# EAGLE design sushi-wing-v3 (EAGLE 7.7.0)
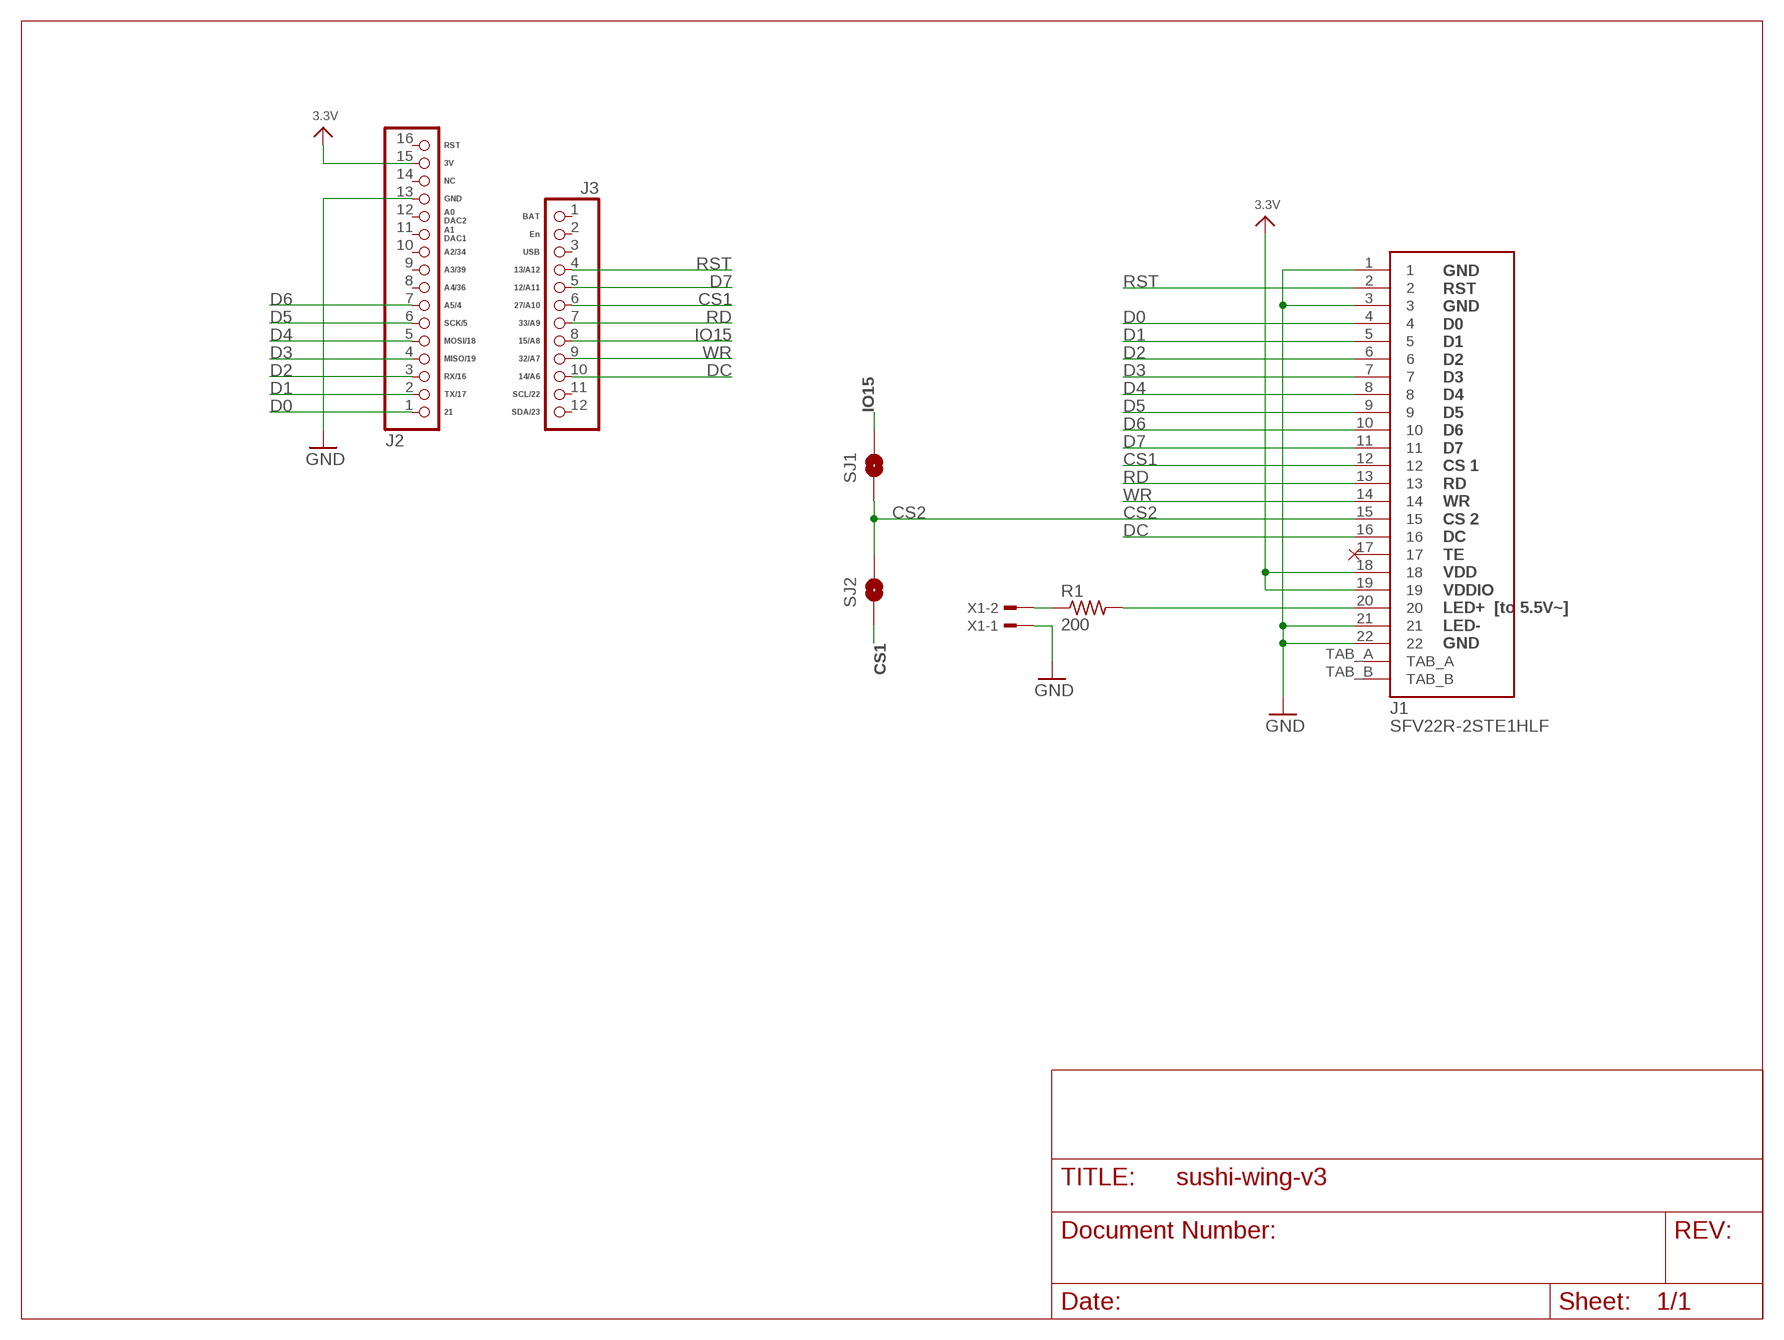
[diagram p0: schematic, sheet 1]

## Parts
J1  SFV22R-2STE1HLF  [SFV22R-2STE1HLF]
J2  HEADER-1X16_MIN  [1X16_ROUND_MIN]
J3  HEADER-1X12_MIN  [1X12_ROUND_MIN]
R1  200  R-US_R1206  [R1206]
SJ1  SOLDERJUMPERNO  [SJ_2S-NO]
SJ2  SOLDERJUMPERNO  [SJ_2S-NO]
X1  TSW-102-02-S-S-RA  [TSW-102-02-S-S-RA]

## Nets
3.3V: J1.18 J1.19 J2.15
CS1: J1.12 J3.6 SJ2.1
CS2: J1.15 SJ1.1 SJ2.2
D0: J1.4 J2.1
D1: J1.5 J2.2
D2: J1.6 J2.3
D3: J1.7 J2.4
D4: J1.8 J2.5
D5: J1.9 J2.6
D6: J1.10 J2.7
D7: J1.11 J3.5
DC: J1.16 J3.10
GND: J1.1 J1.3 J1.21 J1.22 J2.13 X1.1
IO15: J3.8 SJ1.2
N$2: R1.1 X1.2
N$20: J1.20 R1.2
RD: J1.13 J3.7
RST: J1.2 J3.4
WR: J1.14 J3.9
Unconnected: J1.17 J1.TAB_A J1.TAB_B J2.8 J2.9 J2.10 J2.11 J2.12 J2.14 J2.16 J3.1 J3.2 J3.3 J3.11 J3.12

## Notes on the sheet
- RST
- 3V
- NC
- GND
- A0
  DAC2
- BAT
- A1
  DAC1
- En
- A2/34 | USB
- GND
  RST
  GND
  D0
  D1
  D2
  D3
  D4
  D5
  D6
  D7
  CS 1
  RD
  WR
  CS 2
  DC
  TE
  VDD
  VDDIO
  LED+  [to 5.5V~]
  LED-
  GND
- A3/39 | 13/A12
- A4/36 | 12/A11
- A5/4 | 27/A10
- SCK/5 | 33/A9
- MOSI/18 | 15/A8
- MISO/19 | 32/A7
- RX/16 | 14/A6
- TX/17 | SCL/22
- 21 | SDA/23

## Library data of the parts
J1 = SFV22R-2STE1HLF:SFV22R-2STE1HLF
J2 = microbuilder:HEADER-1X16: PIN HEADER
J3 = microbuilder:HEADER-1X12
R1 = rcl:R-US_: RESISTOR, American symbol
SJ1 SJ2 = SparkFun:SOLDERJUMPER: Solder Jumper Standard SMD solder jumper. Used to automate production. Two varients : Normally Open and Normally Closed are the same, but have different paste layers. NC will have a large amount of paste and should jumper during reflow.
X1 = con-samtec:TSW-102-02-S-S: THROUGH-HOLE .025" SQ POST HEADER Source: Samtec TSW.pdf; OC_FARNELL: unknown; OC_NEWARK: unknown

## Board
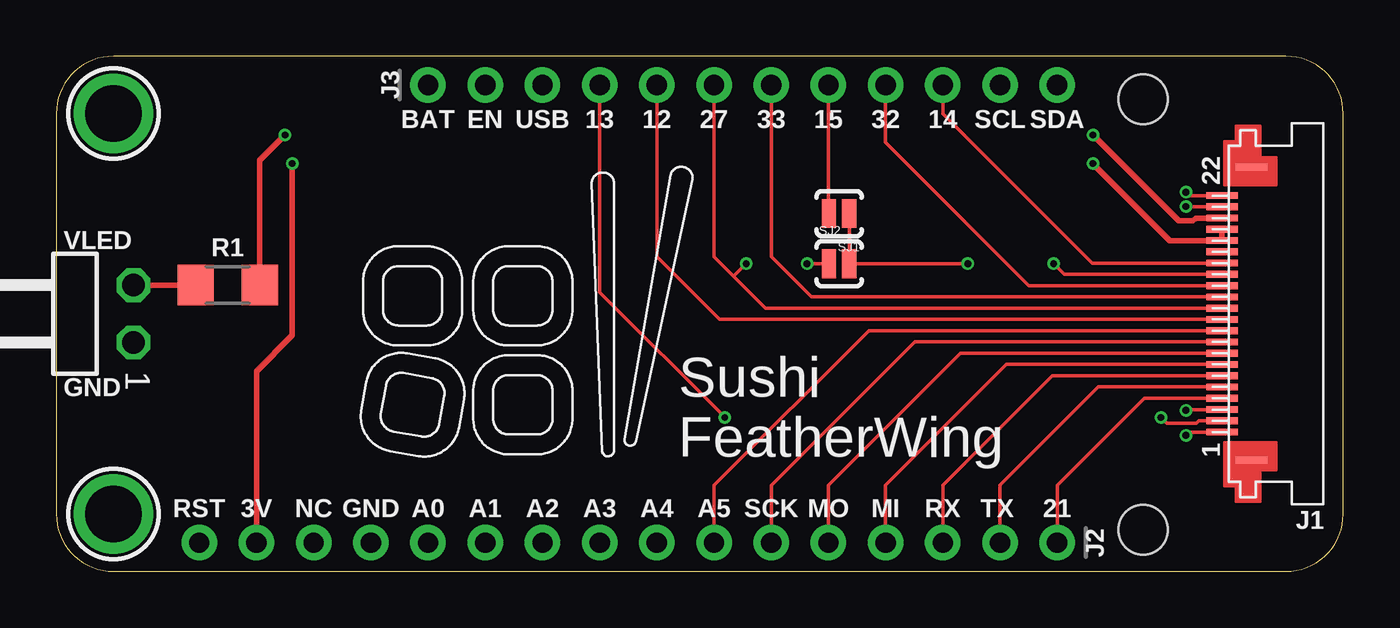
[diagram p1: board, top side]
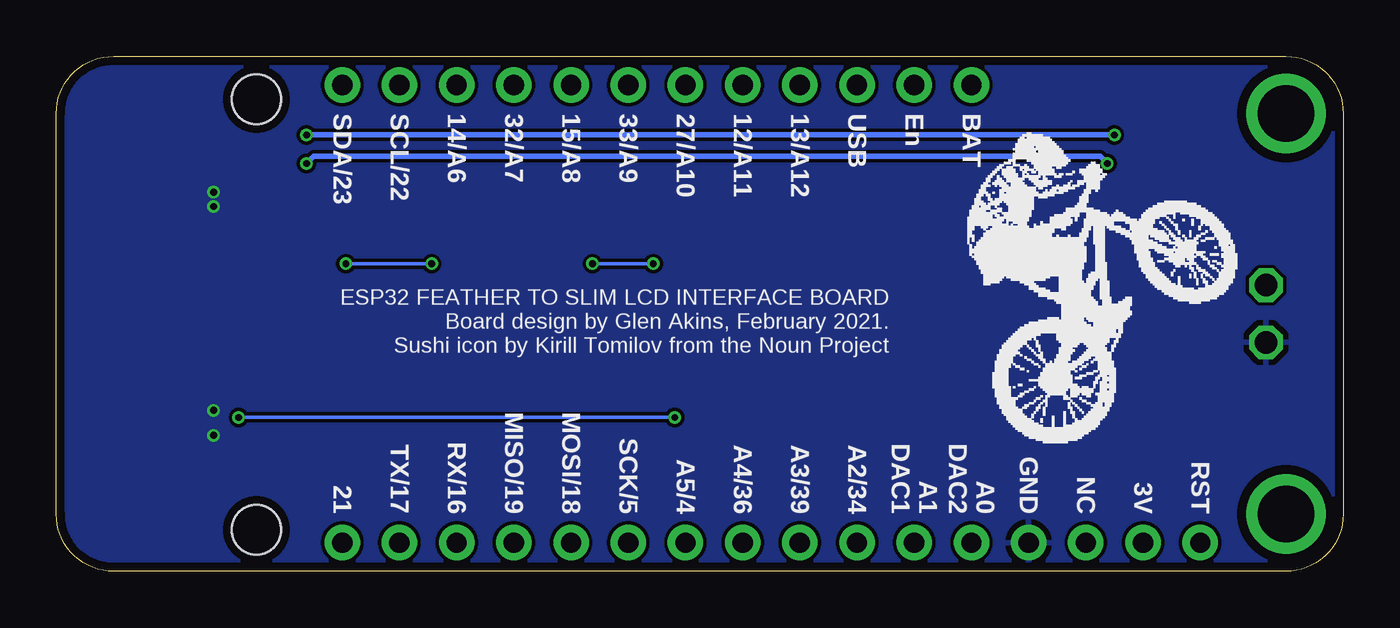
[diagram p2: board, bottom side, seen from below]

Size 57.15 x 22.86 mm. Coordinates in mm from the lower left corner, seen from the top.
Outline: 2.54,0 54.61,0 arc90 57.15,2.54 57.15,20.32 arc90 54.61,22.86 2.54,22.86 arc90 0,20.32 0,2.54 arc90 2.54,0
Copper layers (1*16): Top 0.035559375mm / dielectric 1.6mm / Bottom 0.035559375mm
Design rules "oshpark-2layer-2018": minimum track width 6mil, minimum drill 10mil, track to track 6mil, track to pad 6mil, pad to pad 6mil, via to via 6mil, smd to smd 6mil, copper to edge 15mil, drill to drill 6mil, minimum pad ring 5mil, minimum via ring 5mil, stop-mask expansion 2.5mil, vias tented up to drill 0mil, thermal gap 10mil
Holes 2.2 mm at 48.26,1.84 48.26,20.95

### Footprints (pad centres in the part's own frame; a part is rotated, then mirrored left to right if it is on the bottom)
SFV22R-2STE1HLF = smd 0.3 x 1.4: 1 -5.25,0.3; 2 -4.75,0.3; 3 -4.25,0.3; 4 -3.75,0.3; 5 -3.25,0.3; 6 -2.75,0.3; 7 -2.25,0.3; 8 -1.75,0.3; 9 -1.25,0.3; 10 -0.75,0.3; 11 -0.25,0.3; 12 0.25,0.3; 13 0.75,0.3; 14 1.25,0.3; 15 1.75,0.3; 16 2.25,0.3; 17 2.75,0.3; 18 3.25,0.3; 19 3.75,0.3; 20 4.25,0.3; 21 4.75,0.3; 22 5.25,0.3; TAB_A -6.5,-1; TAB_B 6.5,-1
1X16_ROUND_MIN = drill 0.9 pad 1.575: 1 -19.05,0; 2 -16.51,0; 3 -13.97,0; 4 -11.43,0; 5 -8.89,0; 6 -6.35,0; 7 -3.81,0; 8 -1.27,0; 9 1.27,0; 10 3.81,0; 11 6.35,0; 12 8.89,0; 13 11.43,0; 14 13.97,0; 15 16.51,0; 16 19.05,0
1X12_ROUND_MIN = drill 0.9 pad 1.575: 1 -13.97,0; 2 -11.43,0; 3 -8.89,0; 4 -6.35,0; 5 -3.81,0; 6 -1.27,0; 7 1.27,0; 8 3.81,0; 9 6.35,0; 10 8.89,0; 11 11.43,0; 12 13.97,0
R1206 = smd 1.6 x 1.803: 1 -1.422,0; 2 1.422,0
SJ_2S-NO = smd 0.635 x 1.27: 1 -0.45,0; 2 0.45,0
MOUNTINGHOLE_2.5_PLATED = drill 2.5 pad 3.2: P$1 0,0
TSW-102-02-S-S-RA = drill 1 pad 1.5 octagon: 1 1.27,1.524; 2 -1.27,1.524

### Placement (x,y rotation side)
J1  52.07,11.43 90 top
J2  25.4,1.27 180 top
J3  30.48,21.59 0 top
R1  7.62,12.7 0 top
SJ1  34.77,15.88 180 top
SJ2  34.77,13.65 0 top
U$31  MOUNTINGHOLE2.5  [MOUNTINGHOLE_2.5_PLATED]  2.54,20.32 270 top
U$32  MOUNTINGHOLE2.5  [MOUNTINGHOLE_2.5_PLATED]  2.54,2.54 270 top
X1  1.91,11.43 270 top

### Tracks (layer width: path | path; a pad name or v marks a point on that pad's centre or on a via)
3.3V  (via drill 0.3)
  Top 0.254: J2.15 8.89,8.89 10.48,10.48 v10.48,18.1 | v46.04,18.1 49.45,14.68 J1.18 J1.19
  Bottom 0.254: v10.48,18.1 10.79,18.41 45.72,18.41 v46.04,18.1
CS1  (via drill 0.3)
  Top 0.152: J1.12 31.5,11.68 30.08,13.1 | 30.08,13.1 29.21,13.97 J3.6 | v30.64,13.65 30.08,13.1 | SJ2.1 v33.34,13.65
  Bottom 0.152: v33.34,13.65 v30.64,13.65
CS2  (via drill 0.3)
  Top 0.152: J1.15 44.76,13.18 v44.29,13.65 | v40.48,13.65 SJ2.2 SJ1.1
  Bottom 0.152: v44.29,13.65 v40.48,13.65
D0
  Top 0.152: J2.1 44.45,3.81 48.32,7.68 J1.4
D1
  Top 0.152: J1.5 46.28,8.18 41.91,3.81 J2.2
D2
  Top 0.152: J1.6 44.24,8.68 39.37,3.81 J2.3
D3
  Top 0.152: J1.7 42.2,9.18 36.83,3.81 J2.4
D4
  Top 0.152: J1.8 40.16,9.68 34.29,3.81 J2.5
D5
  Top 0.152: J1.9 38.12,10.18 31.75,3.81 J2.6
D6
  Top 0.152: J1.10 36.08,10.68 29.21,3.81 J2.7
D7
  Top 0.152: J1.11 29.46,11.18 26.67,13.97 J3.5
DC
  Top 0.152: J1.16 46.01,13.68 39.37,20.32 J3.10
GND  (via drill 0.3)
  Top 0.152: J1.21 v50.15,16.18 v50.16,16.19 | J1.22 50.31,16.68 v50.16,16.83 | J1.1 50.31,6.18 v50.16,6.03 | J1.3 50.36,7.18 v50.16,7.14
  pour Bottom (isolate 0.152): 0,0 57.15,0 57.15,22.86 0,22.86
IO15
  Top 0.152: J3.8 34.29,15.9 SJ1.2
N$2
  Top 0.254: X1.2 R1.1
N$20  (via drill 0.3)
  Top 0.254: v10.16,19.37 9.04,18.25 R1.2 | J1.20 50.6,15.68 50.48,15.56 49.85,15.56 v46.04,19.37
  Bottom 0.254: v46.04,19.37 v10.16,19.37
RD
  Top 0.152: J1.13 33.54,12.18 31.75,13.97 J3.7
RST  (via drill 0.3)
  Top 0.152: J1.2 50.73,6.68 50.62,6.58 49.52,6.58 49.52,6.57 49.31,6.57 v49.05,6.83 49.2,6.68 | J3.4 24.13,12.38 v29.69,6.83
  Bottom 0.152: v29.69,6.83 v49.05,6.83
WR
  Top 0.152: J1.14 43.2,12.68 36.83,19.05 J3.9

### Text on the board
_tsilk: BAT | EN | USB | 13 | 12 | 27 | 33 | 15 | 32 | 14 | SCL | SDA | 22 | VLED | GND | 1 | Sushi / FeatherWing | RST | 3V | NC | GND | A0 | A1 | A2 | A3 | A4 | A5 | SCK | MO | MI | RX | TX | 21
_bsilk: BAT | En | USB | 13/A12 | 12/A11 | 27/A10 | 33/A9 | 15/A8 | 32/A7 | 14/A6 | SCL/22 | SDA/23 | ESP32 FEATHER TO SLIM LCD INTERFACE BOARD / Board design by Glen Akins, February 2021. / Sushi icon by Kirill Tomilov from the Noun Project | RST | 3V | NC | GND | A0 / DAC2 | A1 / DAC1 | A2/34 | A3/39 | A4/36 | A5/4 | SCK/5 | MOSI/18 | MISO/19 | RX/16 | TX/17 | 21